# EAGLE design Tesseract_BLDC_POGO (EAGLE 7.7.0)
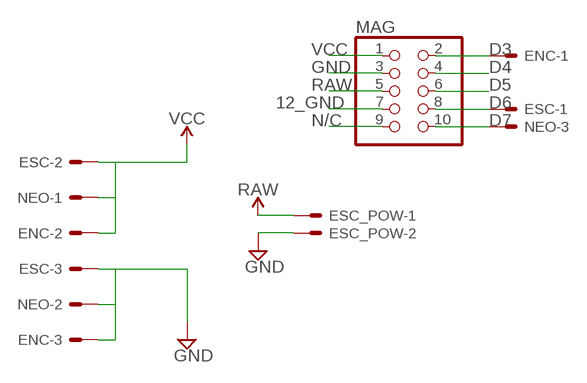
[diagram p0: schematic, sheet 1]

## Parts
ENC  JST-XH-03-PIN-LONG-PAD  [JST-XH-03-PACKAGE-LONG-PAD]
ESC  JST-XH-03-PIN-LONG-PAD  [JST-XH-03-PACKAGE-LONG-PAD]
ESC_POW  JST-XH-02-PIN-LONG-PAD  [JST-XH-02-PACKAGE-LONG-PAD]
MAG  PINHD-2X5  [2X05]
NEO  JST-XH-03-PIN-LONG-PAD  [JST-XH-03-PACKAGE-LONG-PAD]

## Nets
12_GND: ESC_POW.2 MAG.7 ; supply symbol labelled GND
D3: ENC.1 MAG.2
D4: MAG.4
D5: MAG.6
D6: ESC.1 MAG.8
D7: MAG.10 NEO.3
GND: ENC.3 ESC.3 MAG.3 NEO.2
N/C: MAG.9
RAW: ESC_POW.1 MAG.5
VCC: ENC.2 ESC.2 MAG.1 NEO.1

## Library data of the parts
ENC ESC NEO = Rembrandt Electronics - JST XH Connectors v1-0:JST-XH-03-PIN: JST XH Connector 2 Pin Wire to board connector. Pitch: 2,54 mm, (0.100") Number of pins: 3 Created by Rembrandt Electronics www.rembrandtelectronics.com
ESC_POW = Rembrandt Electronics - JST XH Connectors v1-0:JST-XH-02-PIN: JST XH Connector 2 Pin Wire to board connector. Pitch: 2,54 mm, (0.100") Number of pins: 2 Created by Rembrandt Electronics www.rembrandtelectronics.com
MAG = POGO:PINHD-2X5: PIN HEADER

## Board
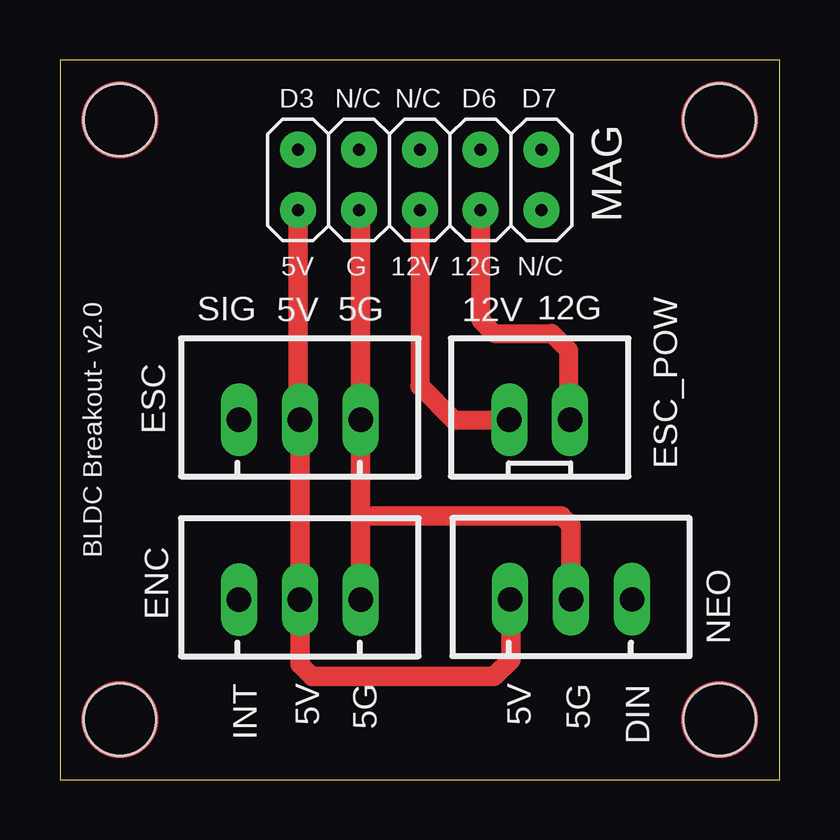
[diagram p1: board, top side]
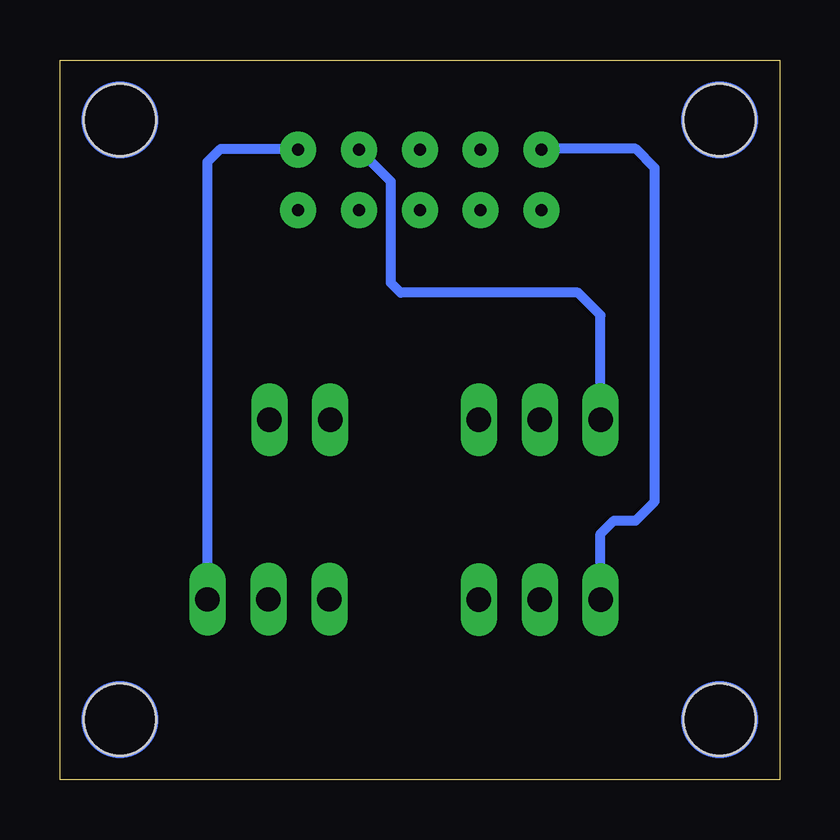
[diagram p2: board, bottom side, seen from below]

Size 30 x 30 mm. Coordinates in mm from the lower left corner, seen from the top.
Outline: 0,0 30,0 30,30 0,30 0,0
Copper layers (1*16): Top 0.035mm / dielectric 1.5mm / Bottom 0.035mm
Design rules "default *": minimum track width 10mil, minimum drill 15mil, track to track 8mil, track to pad 8mil, pad to pad 8mil, via to via 8mil, smd to smd 8mil, copper to edge 40mil, drill to drill 8mil, minimum pad ring 10mil, minimum via ring 8mil, stop-mask expansion 4mil, vias tented up to drill 0mil, thermal gap 10mil
Holes 3 mm at 2.5,27.5 2.5,2.5 27.5,2.5 27.5,27.5

### Footprints (pad centres in the part's own frame; a part is rotated, then mirrored left to right if it is on the bottom)
JST-XH-03-PACKAGE-LONG-PAD = drill 1.016 long: 1 -2.54,0; 2 0,0; 3 2.54,0
JST-XH-02-PACKAGE-LONG-PAD = drill 1.016 long: 1 -1.27,0; 2 1.27,0
2X05 = drill 0.5 pad 1.5: 1 -5.08,-1.27; 2 -5.08,1.27; 3 -2.54,-1.27; 4 -2.54,1.27; 5 0,-1.27; 6 0,1.27; 7 2.54,-1.27; 8 2.54,1.27; 9 5.08,-1.27; 10 5.08,1.27

### Placement (x,y rotation side)
ENC  10,7.5 0 top
ESC  10,15 0 top
ESC_POW  20,15 0 top
MAG  15,25 0 top
NEO  21.31,7.51 0 top

### Tracks (layer width: path | path; a pad name or v marks a point on that pad's centre or on a via)
12_GND
  Top 0.8: MAG.7 17.54,19.16 18.1,18.6 20.5,18.6 21.2,17.9 21.2,15.07 ESC_POW.2
D3
  Bottom 0.254: 9.89,26.3 MAG.2
  Bottom 0.406: ENC.1 7.46,10.24 6.9,10.8 6,10.8 5.2,11.6 5.2,25.5 6,26.3 9.89,26.3
D6
  Bottom 0.406: ESC.1 7.46,19.36 8.4,20.3 15.8,20.3 16.2,20.7 16.2,24.93 MAG.8
D7
  Bottom 0.254: 20.11,26.3 MAG.10
  Bottom 0.406: NEO.3 23.85,25.75 23.3,26.3 20.11,26.3
GND
  Top 0.406: 12.54,10.44 13.1,11 | 21.3,7.52 NEO.2 | 12.54,23.65 MAG.3
  Top 0.813: ENC.3 12.54,10.44 ESC.3 12.54,23.65 | 13.1,11 20.9,11 21.3,10.6 21.3,7.52
RAW
  Top 0.8: MAG.5 15,16.4 16.4,15 ESC_POW.1
VCC
  Top 0.406: 18.8,7.48 NEO.1 | 9.92,15.08 ESC.2
  Top 0.813: 18.8,7.48 18.8,5 18.1,4.3 10.5,4.3 10,4.8 ENC.2 ESC.2 | MAG.1 9.92,15.08
(copper drawn outside any net)
  shapes: Bottom circle x4, Top circle x4

### Text on the board
tNames: D3 | N/C | N/C | D6 | D7 | 5V | G | 12V | 12G | N/C | SIG | 5V | 5G | 12V | 12G | BLDC Breakout- v2.0 | INT | 5V | 5G | 5V | 5G | DIN